# Altium schematic sheet MC21R01_BiSSC.SchDoc: MC21R01 Top Level
size A3; Author: AMP; DrawnBy: AMP; Organization: Altium Limited; Address1: 3 Minna Close; Address2: Belrose; Address3: NSW 2085; Address4: Australia; DocumentNumber: 0; Revision: 1.0; SheetNumber: 0; SheetTotal: 0
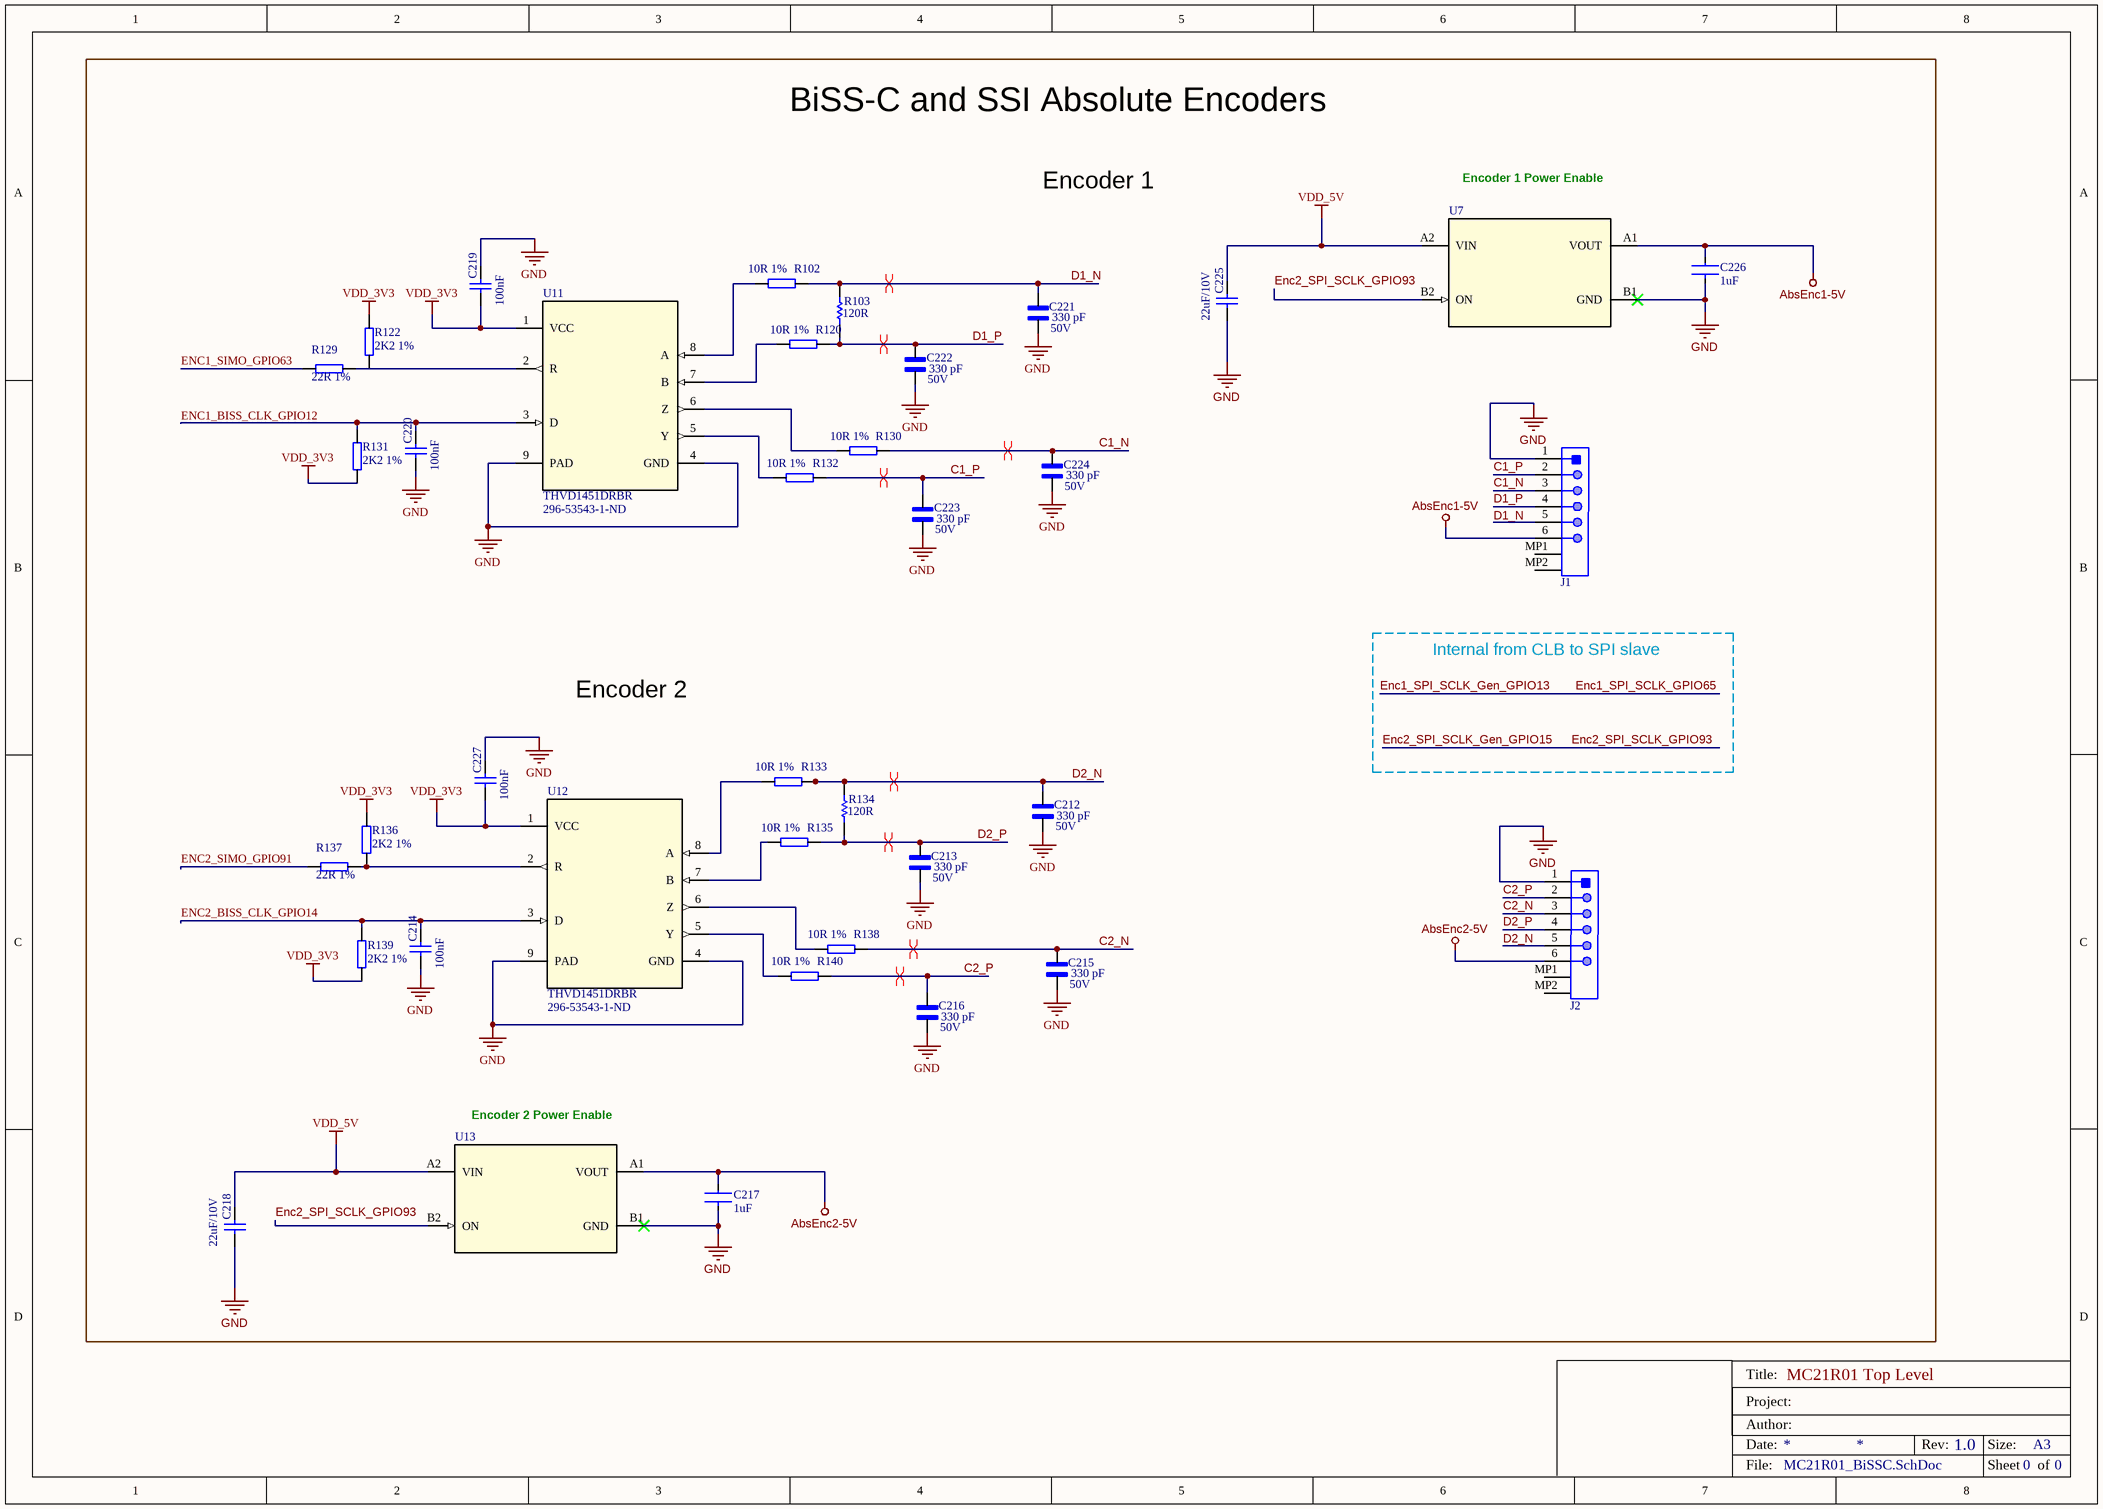
[diagram p0: MC21R01_BiSSC.SchDoc]

## Parts
C212  value 330 pF  Voltage: 50V  [CAPC0603X33N]
C213  value 330 pF  Voltage: 50V  [CAPC0603X33N]  (hidden comment: 330pF/50V 0201 10% X7R)
C214  value 100nF  [CAPC0603X03N]  (hidden comment: 100nF/25V 0201 10% X6S)
C215  value 330 pF  Voltage: 50V  [CAPC0603X33N]  (hidden comment: 330pF/50V 0201 10% X7R)
C216  value 330 pF  Voltage: 50V  [CAPC0603X33N]  (hidden comment: 330pF/50V 0201 10% X7R)
C217  Capacitance: 1uF  [FP-CL03-IPC_C]  (hidden comment: CL03A105MO3NRNH)
C218  value 22uF/10V  [0603 SMD capacitor]  (hidden comment: 22uF/10V 0603 20% X5R)
C219  value 100nF  [CAPC0603X03N]  (hidden comment: 100nF/25V 0201 10% X6S)
C220  value 100nF  [CAPC0603X03N]  (hidden comment: 100nF/25V 0201 10% X6S)
C221  value 330 pF  Voltage: 50V  [CAPC0603X33N]
C222  value 330 pF  Voltage: 50V  [CAPC0603X33N]  (hidden comment: 330pF/50V 0201 10% X7R)
C223  value 330 pF  Voltage: 50V  [CAPC0603X33N]
C224  value 330 pF  Voltage: 50V  [CAPC0603X33N]
C225  value 22uF/10V  [0603 SMD capacitor]  (hidden comment: 22uF/10V 0603 20% X5R)
C226  Capacitance: 1uF  [FP-CL03-IPC_C]  (hidden comment: CL03A105MO3NRNH)
C227  value 100nF  [CAPC0603X03N]  (hidden comment: 100nF/25V 0201 10% X6S)
J1  (no value)  [JST_BM06B-GHS-TBT_LF_SN_N_0]
J2  Conn_JST_BM06B-GHS-TBT_LF_SN_N_eec  [JST_BM06B-GHS-TBT_LF_SN_N_0]  (value not drawn)
R102  10R 1%  [0402 SMD rESISTOR]
R103  Resistance: 120R  [RESC1005X40X25ML05T10]  (hidden comment: CRCW0402120RJNEDHP)
R120  10R 1%  [0402 SMD rESISTOR]
R122  2K2 1%  [0402 SMD rESISTOR]
R129  22R 1%  [0402 SMD rESISTOR]
R130  10R 1%  [0402 SMD rESISTOR]
R131  2K2 1%  [0402 SMD rESISTOR]
R132  10R 1%  [0402 SMD rESISTOR]
R133  10R 1%  [0402 SMD rESISTOR]
R134  Resistance: 120R  [RESC1005X40X25ML05T10]  (hidden comment: CRCW0402120RJNEDHP)
R135  10R 1%  [0402 SMD rESISTOR]
R136  2K2 1%  [0402 SMD rESISTOR]
R137  22R 1%  [0402 SMD rESISTOR]
R138  10R 1%  [0402 SMD rESISTOR]
R139  2K2 1%  [0402 SMD rESISTOR]
R140  10R 1%  [0402 SMD rESISTOR]
U7  (no value)  [YFP0004ABAB]
U11  THVD1451DRBR  Supplier Part Number 1: 296-53543-1-ND  [DRB0008F]
U12  THVD1451DRBR  Supplier Part Number 1: 296-53543-1-ND  [DRB0008F]
U13  (no value)  [YFP0004ABAB]

## Nets
AbsEnc1-5V: C226.2 J1.6 U7.A1(VOUT)
AbsEnc2-5V: C217.2 J2.6 U13.A1(VOUT)
GND: C212.1 C213.1 C214.1 C215.1 C216.1 C217.1 C218.2 C219.2 C220.1 C221.1 C222.1 C223.1 C224.1 C225.2 C226.1 C227.2 J1.1 J2.1 U7.B1(GND) U11.4(GND) U12.4(GND) U13.B1(GND)
VDD_3V3: C219.1 C227.1 R122.2 R131.1 R136.2 R139.1 U11.1(VCC) U12.1(VCC)
VDD_5V: C218.1 C225.1 U7.A2(VIN) U13.A2(VIN)
C1_N: C224.2 J1.3 R130.1
C1_P: C223.2 J1.2 R132.1
C2_N: C215.2 J2.3 R138.1
C2_P: C216.2 J2.2 R140.1
D1_N: C221.2 R102.1 R103.2
D1_P: C222.2 J1.4 R103.1 R120.1
D2_N: C212.2 R133.1 R134.2
D2_P: C213.2 J2.4 R134.1 R135.1
ENC1_BISS_CLK_GPIO12: C220.2 R131.2 U11.3(D)
ENC1_SIMO_GPIO63: R129.2
ENC2_BISS_CLK_GPIO14: C214.2 R139.2 U12.3(D)
ENC2_SIMO_GPIO91: R137.2
Enc2_SPI_SCLK_Gen_GPIO15: U7.B2(ON) U13.B2(ON)  [also labelled Enc2_SPI_SCLK_GPIO93]
NetR102_2: R102.2 U11.8(A)
NetR120_2: R120.2 U11.7(B)
NetR122_1: R122.1 R129.1 U11.2(R)
NetR130_2: R130.2 U11.6(Z)
NetR132_2: R132.2 U11.5(Y)
NetR133_2: R133.2 U12.8(A)
NetR135_2: R135.2 U12.7(B)
NetR136_1: R136.1 R137.1 U12.2(R)
NetR138_2: R138.2 U12.6(Z)
NetR140_2: R140.2 U12.5(Y)

Not connected (* = marked no-connect by the designer): J1 5 MP1 MP2; J2 5 MP1 MP2; U11 9(PAD); U12 9(PAD)

## Layout directives
differential pair: C1_N, C1_P, C2_N, C2_P, D1_N, D1_P, D2_N, D2_P

## Notes on the sheet
- BiSS-C and SSI Absolute Encoders
- Encoder 1
- Encoder 1 Power Enable
- Internal from CLB to SPI slave
- Encoder 2
- (near U13) Encoder 2 Power Enable
- Title:
- Date:
- Project:
- Author:
- Rev:
- Size:
- A3
- File:
- Sheet
- of
- Labels drawn without touching a wire or pin: D1_N, D2_N

## Library data of the parts
C212 C213 C215 C216 C221-C224 = GRM033R71H331KA12D: 330pF/50V 0201 10% Tolerance X7R Multilayer Ceramic Chip Capacitor; MF: Murata; MP: GRM033R71H331KA12D; SnapEDA_Link: https://www.snapeda.com/parts/GRM033R71H331KA12D/Murata/view-part/1976079/?ref=snap; Digi-Key_Purchase_URL: https://www.digikey.com/product-detail/en/murata-electronics/GRM033R71H331KA12D/490-17085-1-ND/7602084?utm_source=snapeda&utm_medium=aggregator&utm_campaign=symbol; Digi-Key_Part_Number: 490-17085-1-ND; Package: 0603 Taiyo Yuden
C214 C219 C220 C227 = CMP-001-00061-1: 100nF/25V 0201 10% Tolerance X6S Multilayer Ceramic Chip Capacitor; Populated: Yes; Provided by customer: No; Voltage Rating (DC): 25V; Capacitance: 100nF; Case/Package: 0201; Case Code (Imperial): 0201; Case Code (Metric): 0603; Dielectric: X6S; Height: 0.3mm; Length: 0.024inch; Max Operating Temperature: 105°C; Min Operating Temperature: -55°C; Mount: Surface Mount; Package Quantity: 15000; Packaging: Tape and Reel; Termination: SMD/SMT; Thickness: 0.013inch; Tolerance: 10%; Voltage Rating: 25V; Weight: 1.2E-05oz; Width: 0.3mm
C217 C226 = CMP-13271-000008-1: CAP CER 1UF 16V X5R 0201; Manufacturer: Samsung Electro-Mechanics; Tolerance: 20%; Material: Ceramic; Temperature Coefficient: 15%; Automotive: No; Temperature Range High: +85°C; Manufacturer Part Number: CL03A105MO3NRNH; Temperature: -55°C to +85°C; Package: CL03; Temperature Range Low: -55°C; Height: 0.39mm; ComponentLink2URL: http://www.samsungsem.com/global/front/downloadcms.do?path=%2F%2Fglobal%2F%2Fsupport%2F%2Fproduct-search%2F%2Fmlcc%2F%2F__icsFiles%2F%2Fafieldfile%2F%2F2018%2F%2F06%2F%2F21&fileName=CL03A105MO3NRNH.pdf; RoHS: TRUE; Value: 1uF; Lead Free: Yes; Voltage Rating: 16V; Octopart: https://octopart.com/cl03a105mo3nrnh-samsung-47681184; Device Class L2: Capacitors; ComponentLink2Description: Datasheet; Device Class L3: Ceramic Capacitors; Digikey Description: CAP CER 1UF 16V X5R 0201; Category: Cap; Temperature Characteristic: X5R; Device Class L1: Passive Components; Ipc Land Pattern Name: CAPC6030X30
C218 C225 = 22uF/10V 0603 20% X5R: 22 uF 10 V 0603 ±20% Tolerance X5R Multilayer Ceramic Chip Capacitor; Manufacturer 1: Murata; Manufacturer Part Number 1: GRM188R60J106KE47D; Supplier 1: Farnell; Supplier Part Number 1: 2426957
J1 J2 = Conn_JST_BM06B-GHS-TBT_LF_SN_N_eec: CONN HEADER GH TOP 6POS 1.25MM; Manufacturer: JST; Part Number: BM06B-GHS-TBT(LF)(SN)(N); helpURL: https://upverter.com/upn/revision/9caaf2120726c690/; ComponentLink2Description: Datasheet; Temperature: -25°C to +85°C; Package: HDR06; Supplier 2: Mouser; Price: 0.396190066284; Supplier 1: Digi-Key; ComponentLink1URL: https://upverter.com/upn/revision/9caaf2120726c690/; Supplier Part Number 1: 455-1582-1-ND; ComponentLink1Description: Upverter; ComponentLink2URL: http://www.jst-mfg.com/product/pdf/eng/eGH.pdf; RoHS: TRUE; Temperature Range High: +85°C; Digikey Description: CONN HEADER GH TOP 6POS 1.25MM; Digikey Part Number: 455-1582-1-ND; Temperature Range Low: -25°C; Lead Free: yes
R102 R120 R130 R132 R133 R135 R138 R140 = 10R/50V 1% 0402 63mW: 10R/50V 1% 0402 63mW SMD Resistor; Manufacturer 1: Yageo; Manufacturer Part Number 1: RC0402FR-0710RL; Supplier 1: Farnell; Supplier Part Number 1: 9238999; Value: 10R
R103 R134 = CRCW0402120RJNEDHP: RES SMD 120 OHM 5% 1/5W 0402; Manufacturer: Vishay Dale; Power Rating: 125mW; Voltage Rating: 50V; Temperature Coefficient: 200ppm/°C; Part Number: CRCW0402120RJNEDHP; Supplier 1: Digi-Key; Manufacturer Part Number: CRCW0402120RJNEDHP; RoHS: Yes; Category: Chip SMD Resistors; Stock 1: 18750; Pricing 1: 1=0,13000, 10=0,11300, 100=0,04350, 1000=0,01912, 2500=0,01651, 5000=0,01477 (USD); Case/Package: 0402; Weight: 2.3E-05oz; Case Code (Metric): 1005; Case Code (Imperial): 0402; Min Operating Temperature: -55°C; Max Operating Temperature: 155°C; Package Quantity: 1; Tolerance: 5%; Packaging: Tape and Reel; Composition: Thick Film; Max Power Dissipation: 125mW; Features: Automotive AEC-Q200; Number of Terminations: 2; Termination: SMD/SMT; Military Standard: Not; Length: 1mm; Height: 0.016inch; Width: 0.02inch; Depth: 0.5mm; Lead Free: Lead Free; ComponentLink1URL: https://datasheet.ciiva.com/12577/crcwhpe3-46056-12577101.pdf?src-supplier=Mouser; ComponentLink1Description: https://datasheet.ciiva.com/12577/crcwhpe3-46056-12577101.pdf?src-supplier=Mouser; ComponentLink2URL: https://datasheet.ciiva.com/6548/crcwhpe3-6548111.pdf?src-supplier=Digi-Key; ComponentLink2Description: https://datasheet.ciiva.com/6548/crcwhpe3-6548111.pdf?src-supplier=Digi-Key; Supplier Part Number 1: 541-120YACT-ND
R122 R131 R136 R139 = 2K2/50V 1% 0402 100mW: 2K2/50V 1% 0402 100mW SMD Resistor; Manufacturer 1: Yageo; Manufacturer Part Number 1: RC0402FR-072K2L; Value: 2.2k; Supplier 1: Farnell; Supplier Part Number 1: 9239278
R129 R137 = 22R/50V 1% 0402 63mW: 22R/50V 1% 0402 63mW SMD Resistor; Manufacturer 1: Vishay; Manufacturer Part Number 1: CRCW040222R0FKED; Supplier 1: Farnell; Supplier Part Number 1: 1469697; Value: 22R
U7 U13 = TPS22916C: TPS22916CY Single-Channel Ultra-Low Leakage Load Switch 2A 60 mO 1V to 5.5V 4-Pin DSBGA T/R; Manufacturer: Texas Instruments; Manufacturer Part Number: TPS22916CYFPR; Number of Channels: 1; Fault Protection: Reverse Current; Output Configuration: High Side; Supplier 1: Digi-Key; RoHS: No; Stock 1: 2282; Pricing 1: 1=0,42000, 10=0,36400, 25=0,33960, 100=0,25220, 250=0,21340, 500=0,20370, 1000=0,15035 (USD); Min Operating Temperature: -40°C; Max Operating Temperature: 85°C; Packaging: Tape and Reel; Number of Outputs: 1; Max Output Current: 2A; ComponentLink1URL: http://www.ti.com/lit/ds/symlink/tps22916.pdf?src-supplier=Digi-Key; ComponentLink1Description: http://www.ti.com/lit/ds/symlink/tps22916.pdf?src-supplier=Digi-Key; Supplier Part Number 1: 296-50065-1-ND
U11 U12 = THVD1451DRBR: Single Transmitter/Receiver RS-422/RS-485 8-Pin VSON EP T/R; Manufacturer: Texas Instruments; Simplex/Duplex: Full Duplex; PartNumber: THVD1451DRBR; RefDes: RefDes; TYPE: TYPE; Value: Value; Supplier 1: Digi-Key; Manufacturer Part Number: THVD1451DRBR; RoHS: No; Stock 1: 1028; Pricing 1: 1=2,66000, 10=2,38700, 25=2,25680, 100=1,85560, 250=1,66500, 500=1,60480, 1000=1,33399 (USD); Min Operating Temperature: -40°C; Max Operating Temperature: 125°C